# Altium schematic sheet TXB0108 Voltage_Level_Translator.SchDoc: TXB0108 Voltage Level Transator
size A4
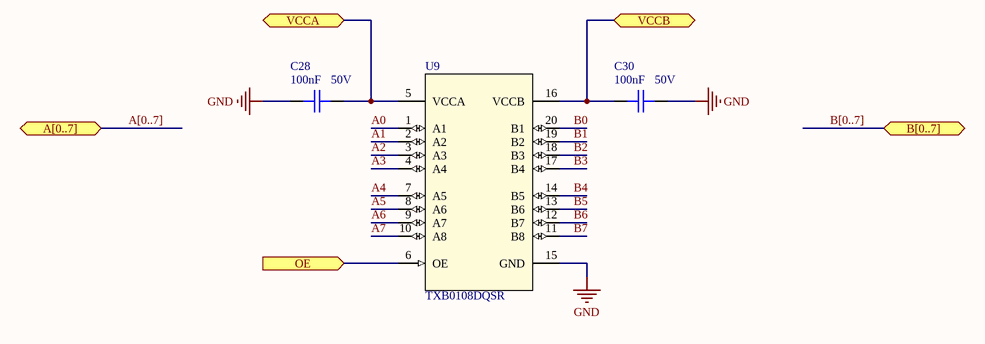
[diagram p0: TXB0108 Voltage_Level_Translator.SchDoc]

## Parts
C28  Capacitance: 100nF  Voltage: 50V  [C0402]  (hidden comment: CAP CER 0.1UF 50V X7R 0402)
C30  Capacitance: 100nF  Voltage: 50V  [C0402]  (hidden comment: CAP CER 0.1UF 50V X7R 0402)
U9  TXB0108DQSR  [DQS20_TEX]

## Ports
A[0..7] (bidir), B[0..7] (bidir), OE (in), VCCA, VCCB

## Nets
GND: C28.1 C30.2 U9.15(GND)
A0: U9.1(A1)
A1: U9.2(A2)
A2: U9.3(A3)
A3: U9.4(A4)
A4: U9.7(A5)
A5: U9.8(A6)
A6: U9.9(A7)
A7: U9.10(A8)
B0: U9.20(B1)
B1: U9.19(B2)
B2: U9.18(B3)
B3: U9.17(B4)
B4: U9.14(B5)
B5: U9.13(B6)
B6: U9.12(B7)
B7: U9.11(B8)
OE: U9.6(OE) ; port OE
VCCA: C28.2 U9.5(VCCA) ; port VCCA
VCCB: C30.1 U9.16(VCCB) ; port VCCB

## Buses and harness runs
bus A[0..7] = port A[0..7]
bus B[0..7] = port B[0..7]

## Notes on the sheet
- Title
- Size:
- Date:
- A4
- Number:
- Time:
- Revision:
- Sheet
- of
- File:

## Library data of the parts
C28 C30 = CAP CER 0.1UF 50V X7R 0402: 0.1µF ±10% 50V Ceramic Capacitor X7R 0402 (1005 Metric); Manufacturer: TDK; Manufacturer Part Number: CGA2B3X7R1H104K050BB; Supplier 1: Digi-Key; Stock 1: 2925303; Pricing 1: 1=0.17, 10=0.118, 50=0.0668, 100=0.0553, 500=0.0388, 1000=0.0321, 2500=0.0299, 5000=0.0273 (USD); Mount: Surface Mount; Case/Package: 0402; Weight: 2.3E-05oz; Case Code (Metric): 1005; Case Code (Imperial): 0402; Min Operating Temperature: -55°C; Max Operating Temperature: 125°C; Voltage Rating: 50V; Tolerance: 10%; Packaging: Tape and Reel; Package Quantity: 1; Voltage Rating (DC): 50V; Dielectric: X7R; Termination: SMD/SMT; Composition: Ceramic; Length: 1mm; Height: 0.5mm; Width: 0.02inch; Thickness: 0.022inch; Depth: 0.5mm; Ratings: AEC-Q200; REACH SVHC: No SVHC; Lead Free: Lead Free; ComponentLink1URL: http://product.tdk.com/capacitor/mlcc/en/documents/mlccspec_automotive_general_midvoltage_en.pdf?src-supplier=Future+Electronics; ComponentLink1Description: http://product.tdk.com/capacitor/mlcc/en/documents/mlccspec_automotive_general_midvoltage_en.pdf?src-supplier=Future+Electronics; ComponentLink2URL: http://www.farnell.com/datasheets/1807242.pdf?src-supplier=Element14; ComponentLink2Description: http://www.farnell.com/datasheets/1807242.pdf?src-supplier=Element14; ComponentLink3URL: http://www.mouser.com/ds/2/400/lcc_automotive_general_en-843974.pdf?src-supplier=Mouser; ComponentLink3Description: http://www.mouser.com/ds/2/400/lcc_automotive_general_en-843974.pdf?src-supplier=Mouser; ComponentLink4URL: http://www.farnell.com/datasheets/1936565.pdf?src-supplier=Element14; ComponentLink4Description: http://www.farnell.com/datasheets/1936565.pdf?src-supplier=Element14; ComponentLink5URL: http://www.farnell.com/datasheets/1735392.pdf?src-supplier=Element14; ComponentLink5Description: http://www.farnell.com/datasheets/1735392.pdf?src-supplier=Element14; Supplier Part Number 1: 445-6899-1-ND
U9 = IC TXB0108 TRNSLTR BIDIRECTIONAL 20USON: Voltage Level Translator Bidirectional 1 Circuit 8 Channel 100Mbps 20-USON (4x2); Manufacturer: Texas Instruments; Propagation Delay: 4ns; Min Supply Voltage: 1.2V; Max Supply Voltage: 5.5V; Number of Channels: 8; High Level Output Current: -20uA; Low Level Output Current: 20uA; Turn-On Delay Time: 35.6ns; Quiescent Current: 3.5uA; Supplier 1: Digi-Key; Manufacturer Part Number: TXB0108DQSR; Stock 1: 18752; Pricing 1: 1=1.29, 10=1.151, 25=1.092, 100=0.897, 250=0.8385, 500=0.741, 1000=0.585 (USD); Mount: Surface Mount; Number of Pins: 20; Min Operating Temperature: -40°C; Max Operating Temperature: 85°C; Data Rate: 100Mbps; Packaging: Tape and Reel; Package Quantity: 1; Logic Function: Translator; Number of Bits: 8; Number of Inputs: 8; Radiation Hardening: No; Lead Free: Lead Free; REACH SVHC: No SVHC; ComponentLink1URL: http://www.ti.com/general/docs/lit/getliterature.tsp?genericPartNumber=TXB0108&amp;&amp;fileType=pdf&src-supplier=Element14; ComponentLink1Description: http://www.ti.com/general/docs/lit/getliterature.tsp?genericPartNumber=TXB0108&amp;&amp;fileType=pdf&src-supplier=Element14; ComponentLink2URL: http://www.ti.com/general/docs/suppproductinfo.tsp?distId=10&gotoUrl=http%3A%2F%2Fwww.ti.com%2Flit%2Fgpn%2Ftxb0108&src-supplier=Digi-Key; ComponentLink2Description: http://www.ti.com/general/docs/suppproductinfo.tsp?distId=10&gotoUrl=http%3A%2F%2Fwww.ti.com%2Flit%2Fgpn%2Ftxb0108&src-supplier=Digi-Key; ComponentLink3URL: http://www.ti.com/lit/ds/symlink/txb0108.pdf?src-supplier=Avnet+Europe; ComponentLink3Description: http://www.ti.com/lit/ds/symlink/txb0108.pdf?src-supplier=Avnet+Europe; ComponentLink4URL: http://www.ti.com/general/docs/lit/getliterature.tsp?genericPartNumber=TXB0108&&fileType=pdf&src-supplier=Avnet; ComponentLink4Description: http://www.ti.com/general/docs/lit/getliterature.tsp?genericPartNumber=TXB0108&&fileType=pdf&src-supplier=Avnet; Supplier Part Number 1: 296-27217-1-ND